# Altium schematic sheet 基准.SchDoc
size A4
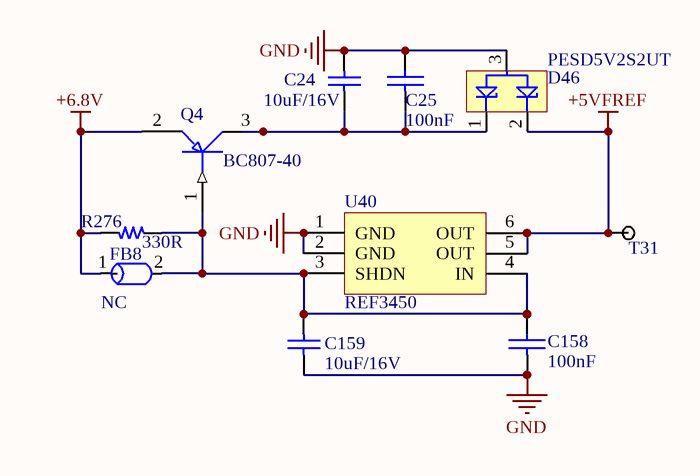
[diagram p0: 基准.SchDoc]

## Parts
C24  10uF/16V  [C-0805]
C25  100nF  [C-0603]
C158  100nF  [C-0603]
C159  10uF/16V  [C-0805]
D46  PESD5V2S2UT  [sot23-3]
FB8  NC  [R-0805]
Q4  BC807-40  [SOT23-3]
R276  330R  [R-0805]
T31  直插测试点  [DIPTP]  (value not drawn)
U40  REF3450  [SOT23-6]

## Nets
+5VFREF: D46.2 T31.1 U40.5(OUT) U40.6(OUT)
+6.8V: FB8.1 Q4.2(E) R276.2(BOT)
GND: C24.2 C25.2 C158.1 C159.1 D46.3 U40.1(GND) U40.2(GND)
NetC24_1: C24.1 C25.1 D46.1 Q4.3(C)
NetC158_2: C158.2 C159.2 FB8.2 Q4.1(B) R276.1(TOP) U40.3(SHDN) U40.4(IN)

## Library data of the parts
C24 C159 = 100nF_1: 贴片瓷介电容100nF±5%,0805; 物料编号: 210001894; 详细描述: X7R,50V,三星CL21B104JBCNNNC; 版本: V1.00; 制造商: 三星; 名称: 贴片瓷介电容100nF±5%,0805
C25 C158 = CAP: Capacitor
D46 = PESDxS2UT
FB8 = FB_1K/500mA_0805: Rdc0.3Ω,伍尔特,742792032; 名称: 贴片磁珠1K/500mA，0805; 版本: V1.00; 物料编号: 210001925; 详细描述: Rdc0.3,R材料,TDK MMZ2012R102A; 制造商: TDK
Q4 = BC807-40: 版本: V1.00; 物料编号: *; 详细描述: *
R276 = 100Ω_1: 国巨RC0805FR-07100R; 物料编号: 210000765; 详细描述: 0805,1/8W,国巨RC0805FR-07100R; 制造商: 国巨; 版本: V1.00; 名称: 贴片电阻100±1%
T31 = Testpiont: 版本: V1.00; 名称: 直插测试点
U40 = REF3225